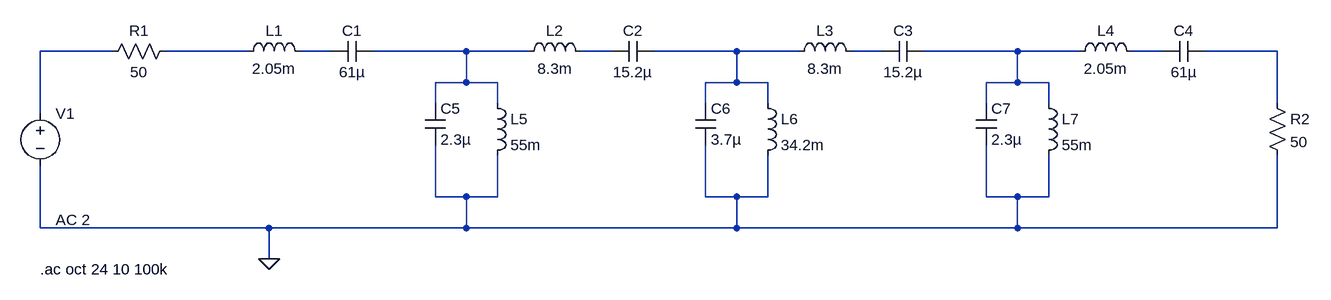
[diagram p0: schematic Draft4 BandPass.asc]
Draft4 BandPass.asc, the LTspice schematic file:
Version 4.1
SHEET 1 2088 680
WIRE 240 0 128 0
WIRE 448 0 320 0
WIRE 576 0 528 0
WIRE 784 0 640 0
WIRE 880 0 784 0
WIRE 1008 0 960 0
WIRE 1200 0 1072 0
WIRE 1296 0 1200 0
WIRE 1424 0 1376 0
WIRE 1632 0 1488 0
WIRE 1728 0 1632 0
WIRE 1856 0 1808 0
WIRE 2032 0 1920 0
WIRE 784 48 784 0
WIRE 784 48 736 48
WIRE 832 48 784 48
WIRE 1200 48 1200 0
WIRE 1200 48 1152 48
WIRE 1248 48 1200 48
WIRE 1632 48 1632 0
WIRE 1632 48 1584 48
WIRE 1680 48 1632 48
WIRE 736 80 736 48
WIRE 832 80 832 48
WIRE 1152 80 1152 48
WIRE 1248 80 1248 48
WIRE 1584 80 1584 48
WIRE 1680 80 1680 48
WIRE 2032 80 2032 0
WIRE 128 96 128 0
WIRE 736 224 736 144
WIRE 784 224 736 224
WIRE 832 224 832 160
WIRE 832 224 784 224
WIRE 1152 224 1152 144
WIRE 1200 224 1152 224
WIRE 1248 224 1248 160
WIRE 1248 224 1200 224
WIRE 1584 224 1584 144
WIRE 1632 224 1584 224
WIRE 1680 224 1680 160
WIRE 1680 224 1632 224
WIRE 128 272 128 176
WIRE 480 272 128 272
WIRE 784 272 784 224
WIRE 784 272 480 272
WIRE 1200 272 1200 224
WIRE 1200 272 784 272
WIRE 1632 272 1632 224
WIRE 1632 272 1200 272
WIRE 2032 272 2032 160
WIRE 2032 272 1632 272
WIRE 480 320 480 272
FLAG 480 320 0
SYMBOL voltage 128 80 R0
WINDOW 3 24 152 Left 2
WINDOW 123 24 180 Left 2
WINDOW 39 0 0 Left 0
SYMATTR Value ""
SYMATTR Value2 AC 2
SYMATTR InstName V1
SYMBOL res 336 -16 R90
WINDOW 0 0 56 VBottom 2
WINDOW 3 32 56 VTop 2
SYMATTR InstName R1
SYMATTR Value 50
SYMBOL ind 432 16 R270
WINDOW 0 32 56 VTop 2
WINDOW 3 5 56 VBottom 2
SYMATTR InstName L1
SYMATTR Value 2.05m
SYMBOL cap 640 -16 R90
WINDOW 0 0 32 VBottom 2
WINDOW 3 32 32 VTop 2
SYMATTR InstName C1
SYMATTR Value 61µ
SYMBOL cap 1072 -16 R90
WINDOW 0 0 32 VBottom 2
WINDOW 3 32 32 VTop 2
SYMATTR InstName C2
SYMATTR Value 15.2µ
SYMBOL cap 1488 -16 R90
WINDOW 0 0 32 VBottom 2
WINDOW 3 32 32 VTop 2
SYMATTR InstName C3
SYMATTR Value 15.2µ
SYMBOL cap 1920 -16 R90
WINDOW 0 0 32 VBottom 2
WINDOW 3 32 32 VTop 2
SYMATTR InstName C4
SYMATTR Value 61µ
SYMBOL ind 864 16 R270
WINDOW 0 32 56 VTop 2
WINDOW 3 5 56 VBottom 2
SYMATTR InstName L2
SYMATTR Value 8.3m
SYMBOL ind 1280 16 R270
WINDOW 0 32 56 VTop 2
WINDOW 3 5 56 VBottom 2
SYMATTR InstName L3
SYMATTR Value 8.3m
SYMBOL ind 1712 16 R270
WINDOW 0 32 56 VTop 2
WINDOW 3 5 56 VBottom 2
SYMATTR InstName L4
SYMATTR Value 2.05m
SYMBOL ind 816 64 R0
SYMATTR InstName L5
SYMATTR Value 55m
SYMBOL ind 1232 64 R0
SYMATTR InstName L6
SYMATTR Value 34.2m
SYMBOL ind 1664 64 R0
SYMATTR InstName L7
SYMATTR Value 55m
SYMBOL cap 720 80 R0
SYMATTR InstName C5
SYMATTR Value 2.3µ
SYMBOL cap 1136 80 R0
SYMATTR InstName C6
SYMATTR Value 3.7µ
SYMBOL cap 1568 80 R0
SYMATTR InstName C7
SYMATTR Value 2.3µ
SYMBOL res 2016 64 R0
SYMATTR InstName R2
SYMATTR Value 50
TEXT 128 336 Left 2 !.ac oct 24 10 100k

The netlist it stands for:
* Draft4 BandPass.asc
V1 N001 0 AC 2
R1 N002 N001 50
L1 N002 N003 2.05m
C1 N004 N003 61µ
C2 N006 N005 15.2µ
C3 N008 N007 15.2µ
C4 N010 N009 61µ
L2 N004 N005 8.3m
L3 N006 N007 8.3m
L4 N008 N009 2.05m
L5 N004 0 55m
L6 N006 0 34.2m
L7 N008 0 55m
C5 N004 0 2.3µ
C6 N006 0 3.7µ
C7 N008 0 2.3µ
R2 N010 0 50
.ac oct 24 10 100k
.backanno
.end